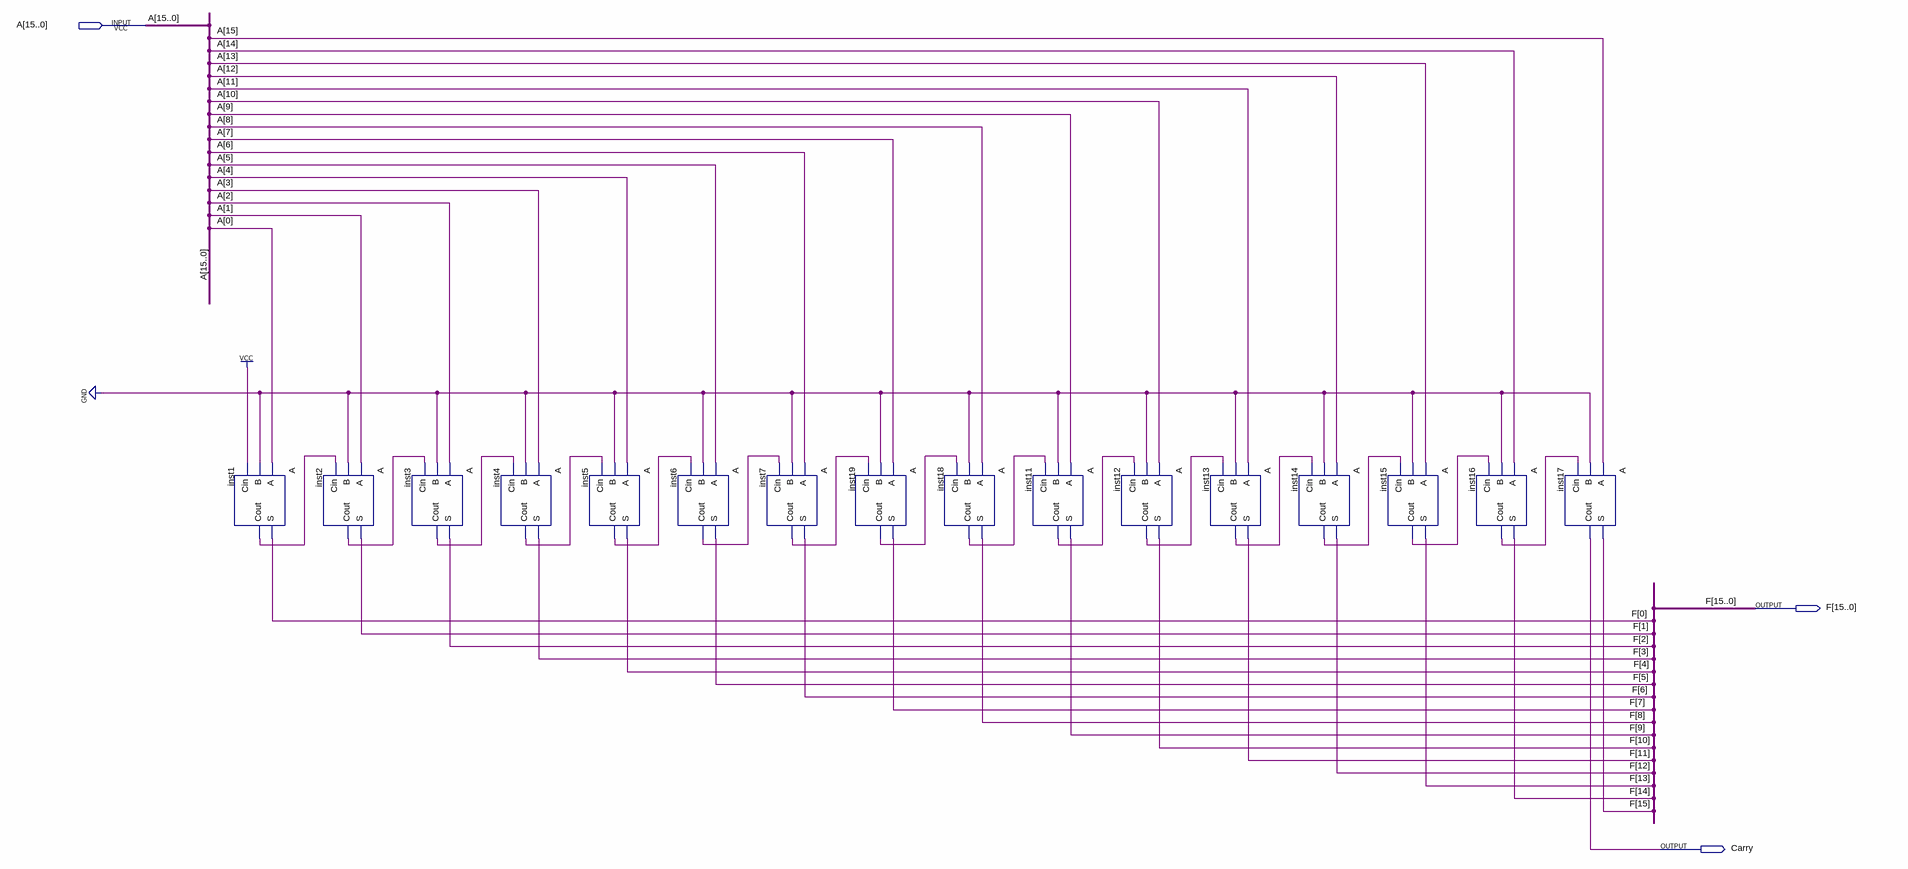
[diagram p0: schematic sheet]
// Quartus schematic Acong.bdf as structural Verilog: 16 symbols, 3 pins
module Acong (
  input  [15:0] A,
  output [15:0] F,
  output Carry
);

  wire inst1_cout, inst2_cout, inst3_cout, inst4_cout, inst5_cout, inst6_cout, inst7_cout, inst11_cout,
       inst12_cout, inst13_cout, inst14_cout, inst15_cout, inst16_cout, inst18_cout, inst19_cout;

  A inst1 (.A(A[0]), .B(1'b0), .Cin(1'b1), .S(F[0]), .Cout(inst1_cout));
  A inst2 (.A(A[1]), .B(1'b0), .Cin(inst1_cout), .S(F[1]), .Cout(inst2_cout));
  A inst3 (.A(A[2]), .B(1'b0), .Cin(inst2_cout), .S(F[2]), .Cout(inst3_cout));
  A inst4 (.A(A[3]), .B(1'b0), .Cin(inst3_cout), .S(F[3]), .Cout(inst4_cout));
  A inst5 (.A(A[4]), .B(1'b0), .Cin(inst4_cout), .S(F[4]), .Cout(inst5_cout));
  A inst6 (.A(A[5]), .B(1'b0), .Cin(inst5_cout), .S(F[5]), .Cout(inst6_cout));
  A inst7 (.A(A[6]), .B(1'b0), .Cin(inst6_cout), .S(F[6]), .Cout(inst7_cout));
  A inst19 (.A(A[7]), .B(1'b0), .Cin(inst7_cout), .S(F[7]), .Cout(inst19_cout));
  A inst18 (.A(A[8]), .B(1'b0), .Cin(inst19_cout), .S(F[8]), .Cout(inst18_cout));
  A inst11 (.A(A[9]), .B(1'b0), .Cin(inst18_cout), .S(F[9]), .Cout(inst11_cout));
  A inst12 (.A(A[10]), .B(1'b0), .Cin(inst11_cout), .S(F[10]), .Cout(inst12_cout));
  A inst13 (.A(A[11]), .B(1'b0), .Cin(inst12_cout), .S(F[11]), .Cout(inst13_cout));
  A inst14 (.A(A[12]), .B(1'b0), .Cin(inst13_cout), .S(F[12]), .Cout(inst14_cout));
  A inst15 (.A(A[13]), .B(1'b0), .Cin(inst14_cout), .S(F[13]), .Cout(inst15_cout));
  A inst16 (.A(A[14]), .B(1'b0), .Cin(inst15_cout), .S(F[14]), .Cout(inst16_cout));
  A inst17 (.A(A[15]), .B(1'b0), .Cin(inst16_cout), .S(F[15]), .Cout(Carry));
endmodule
